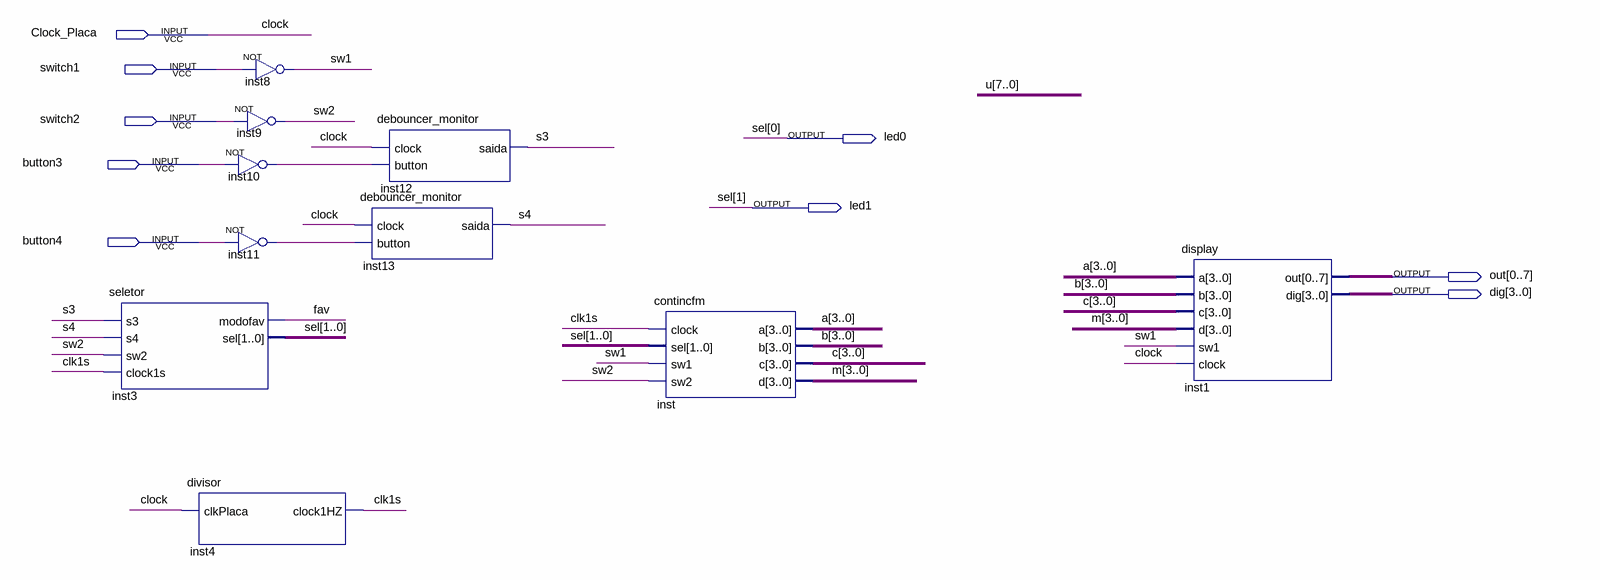
[diagram p0: schematic sheet]
// Quartus schematic sipo_ada.bdf as structural Verilog: 10 symbols, 9 pins
module sipo_ada (
  input  Clock_Placa,
  input  switch1,
  input  switch2,
  input  button3,
  input  button4,
  output led0,
  output led1,
  output [0:7] out,
  output [3:0] dig
);

  wire clk1s, fav, inst10_out, inst11_out, s3, s4, sw1, sw2;
  wire [3:0] a, b, c, m;

  seletor inst3 (.s3(s3), .s4(s4), .sw2(sw2), .clock1s(clk1s), .modofav(fav), .sel({led1, led0}));
  divisor inst4 (.clkPlaca(Clock_Placa), .clock1HZ(clk1s));
  not inst8 (sw1, switch1);
  not inst9 (sw2, switch2);
  not inst10 (inst10_out, button3);
  not inst11 (inst11_out, button4);
  debouncer_monitor inst12 (.clock(Clock_Placa), .button(inst10_out), .saida(s3));
  debouncer_monitor inst13 (.clock(Clock_Placa), .button(inst11_out), .saida(s4));
  contincfm inst (.clock(clk1s), .sel({led1, led0}), .sw1(sw1), .sw2(sw2), .a(a), .b(b), .c(c), .d(m));
  display inst1 (.a(a), .b(b), .c(c), .d(m), .sw1(sw1), .clock(Clock_Placa), .out(out), .dig(dig));

  // Other names for the same wires on the sheet: clock = Clock_Placa; sel[1:0] = {led1, led0}
endmodule
